# Altium schematic sheet Digital Port C.SchDoc: Port C Digital Control
size A4
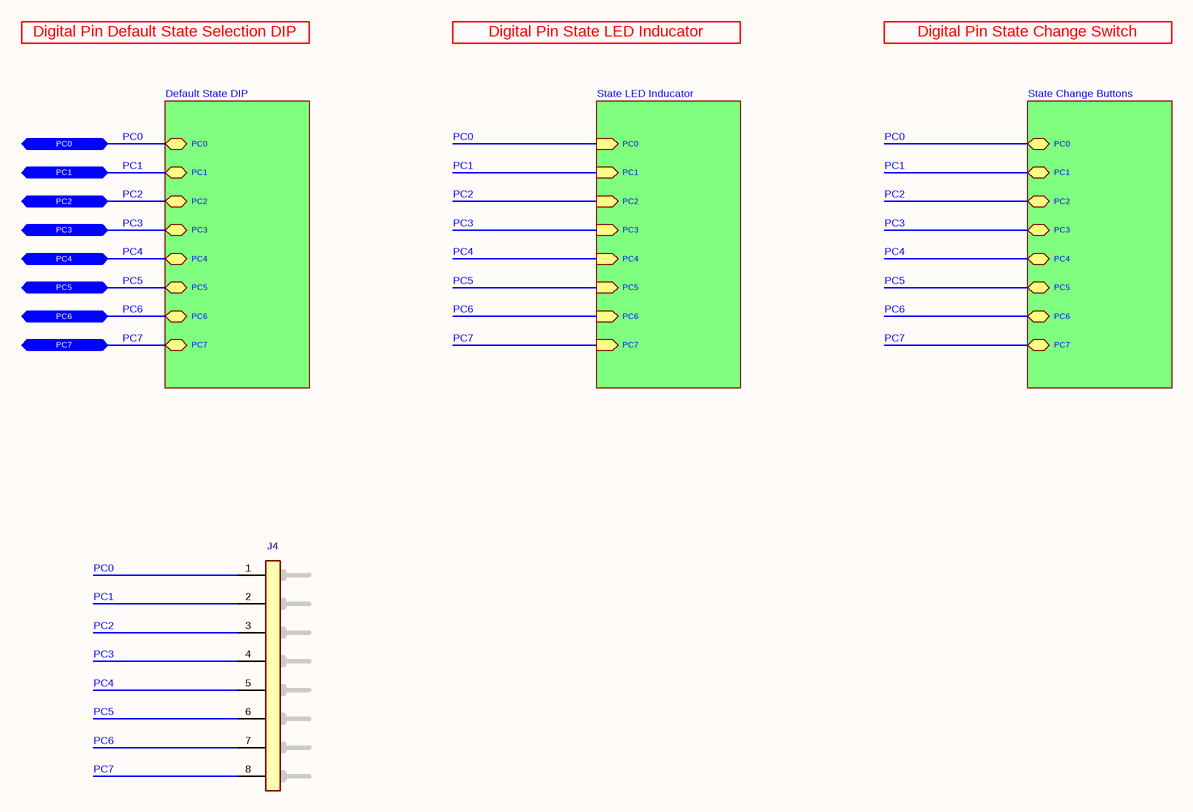
[diagram p0: Digital Port C.SchDoc]

## Parts
J4  2.54 mm Pitch 8P Male Connector  [8P Header]  (value not drawn)

## Sub-sheets
Default State DIP = Digital Port C Default State DIP.SchDoc: PC1 (bidir), PC0 (bidir), PC7 (bidir), PC4 (bidir), PC6 (bidir), PC3 (bidir), PC5 (bidir), PC2 (bidir)
State Change Buttons = Digital Port C Button.SchDoc: PC1 (bidir), PC0 (bidir), PC7 (bidir), PC4 (bidir), PC6 (bidir), PC3 (bidir), PC5 (bidir), PC2 (bidir)
State LED Inducator = Digital Port C State LED Inducator.SchDoc: PC1 (in), PC0 (in), PC7 (in), PC4 (in), PC6 (in), PC3 (in), PC5 (in), PC2 (in)

## Ports
PC0 (bidir), PC1 (bidir), PC2 (bidir), PC3 (bidir), PC4 (bidir), PC5 (bidir), PC6 (bidir), PC7 (bidir)

## Nets
PC0: J4.1(Pin-1) ; port PC0, sheet Default State DIP/PC0, sheet State LED Inducator/PC0, sheet State Change Buttons/PC0
PC1: J4.2(Pin-2) ; port PC1, sheet Default State DIP/PC1, sheet State LED Inducator/PC1, sheet State Change Buttons/PC1
PC2: J4.3(Pin-3) ; port PC2, sheet Default State DIP/PC2, sheet State LED Inducator/PC2, sheet State Change Buttons/PC2
PC3: J4.4(Pin-4) ; port PC3, sheet Default State DIP/PC3, sheet State LED Inducator/PC3, sheet State Change Buttons/PC3
PC4: J4.5(Pin-5) ; port PC4, sheet Default State DIP/PC4, sheet State LED Inducator/PC4, sheet State Change Buttons/PC4
PC5: J4.6(Pin-6) ; port PC5, sheet Default State DIP/PC5, sheet State LED Inducator/PC5, sheet State Change Buttons/PC5
PC6: J4.7(Pin-7) ; port PC6, sheet Default State DIP/PC6, sheet State LED Inducator/PC6, sheet State Change Buttons/PC6
PC7: J4.8(Pin-8) ; port PC7, sheet Default State DIP/PC7, sheet State LED Inducator/PC7, sheet State Change Buttons/PC7

## Notes on the sheet
- Digital Pin Default State Selection DIP
- Digital Pin State LED Inducator
- Digital Pin State Change Switch
- Title
- Size:
- Date:
- A4
- Number:
- Time:
- Revision:
- Sheet
- of
- File:

## Library data of the parts
J4 = Connector - Male Header 8P (2.54): Headers & Wire Housings BREAKAWAY HDR VERT 8; Manufacturer Name: Molex; Position: 8; Row: 1; Pitch: 2.54 mm; Manufacturer Part Number: 22-28-4083; Mouser Part Number: 538-22-28-4083; ROHS: Yes; ComponentLink1Description: DataSheet; ComponentLink1URL: https://www.mouser.com.tr/datasheet/2/276/0022284063_PCB_HEADERS-228265.pdf; ComponentLink2Description: Mouser; ComponentLink2URL: https://www.mouser.com.tr/ProductDetail/Molex/22-28-4083/?qs=%2Fha2pyFaduguMWEp6M%252Bj0x6fHxUvnRGD%252BIxBoa6MO5w%3D